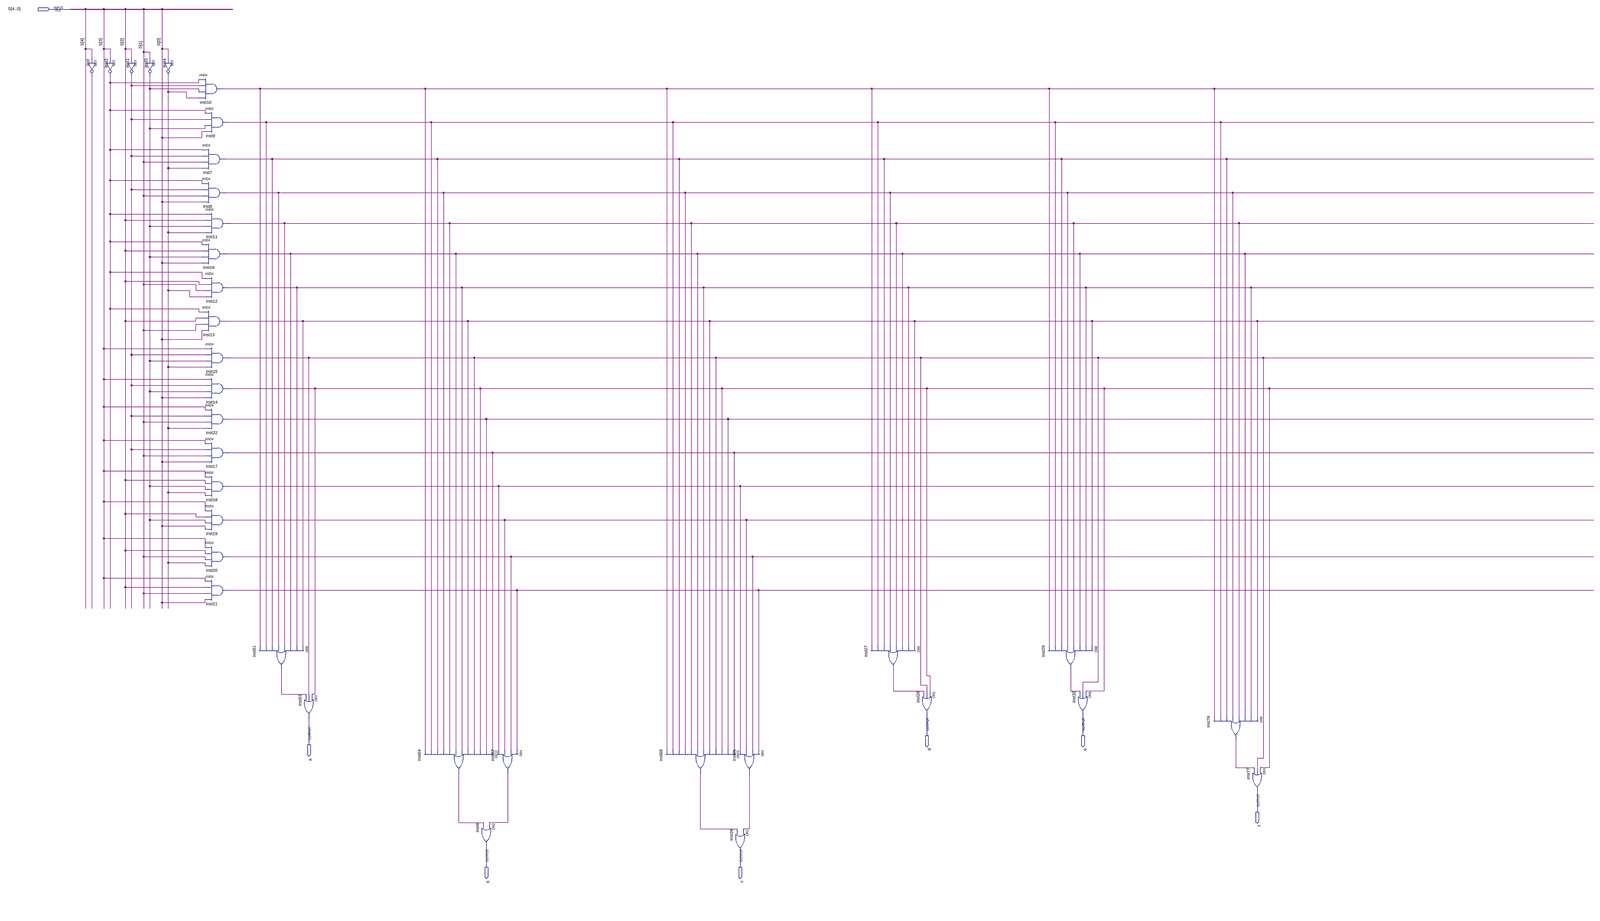
[diagram p0: schematic sheet, whole]
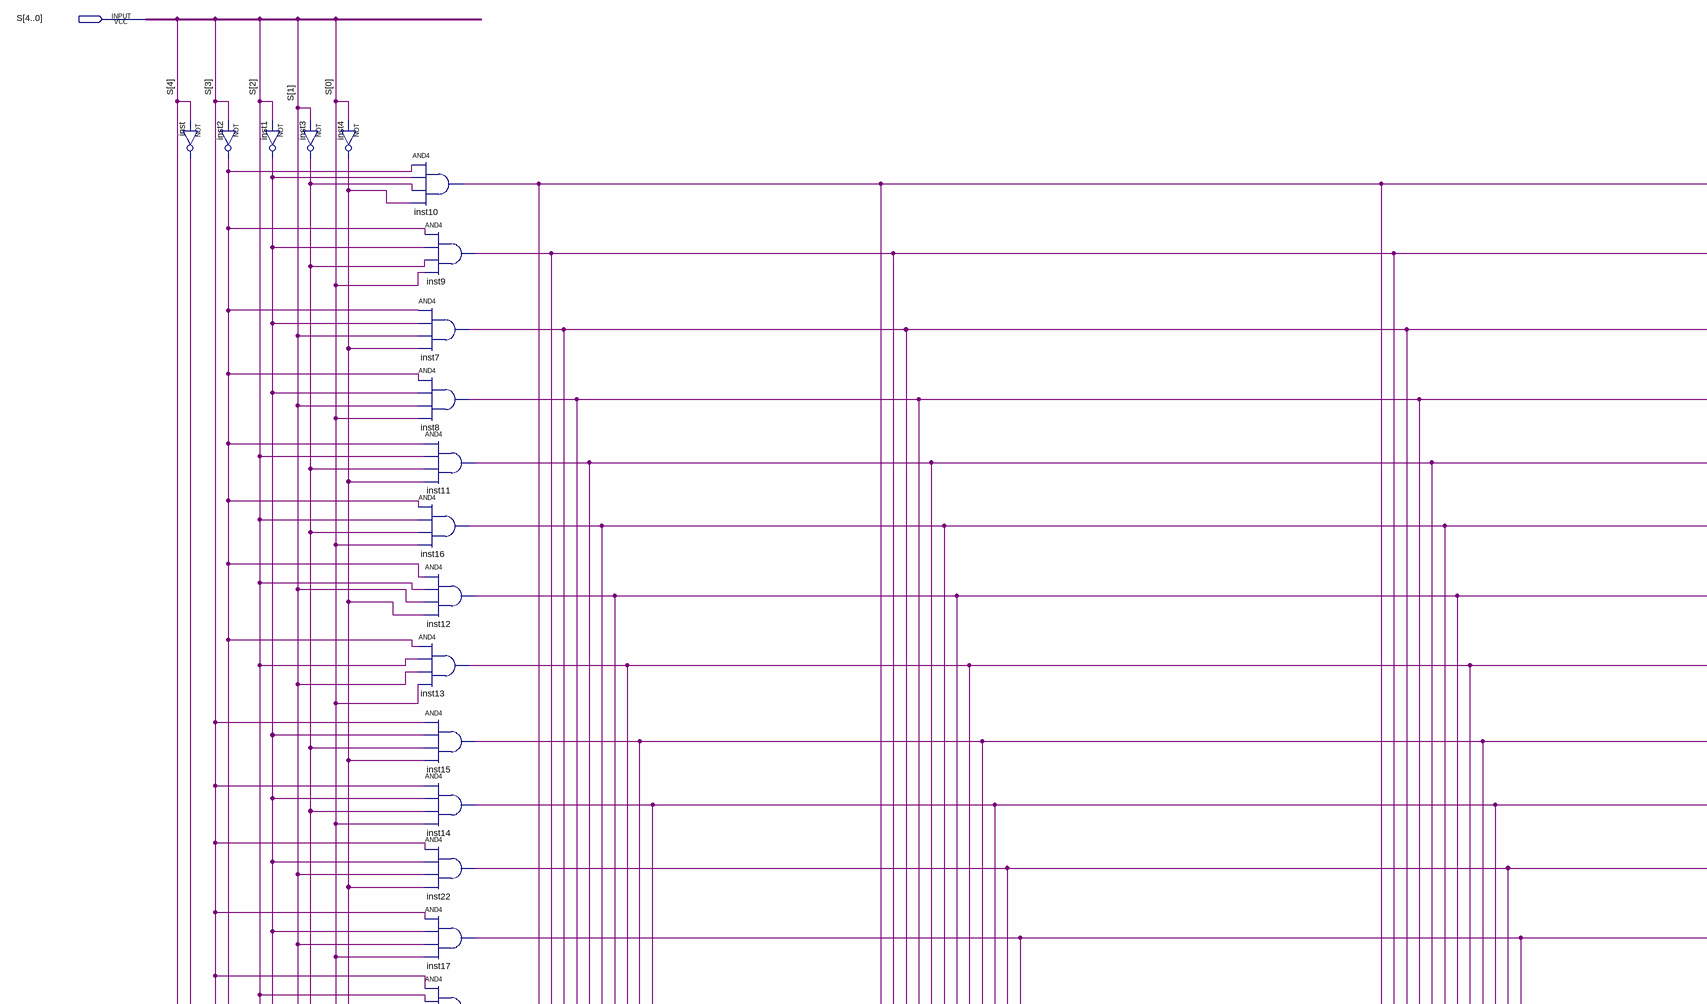
[diagram p1: schematic sheet, upper left part]
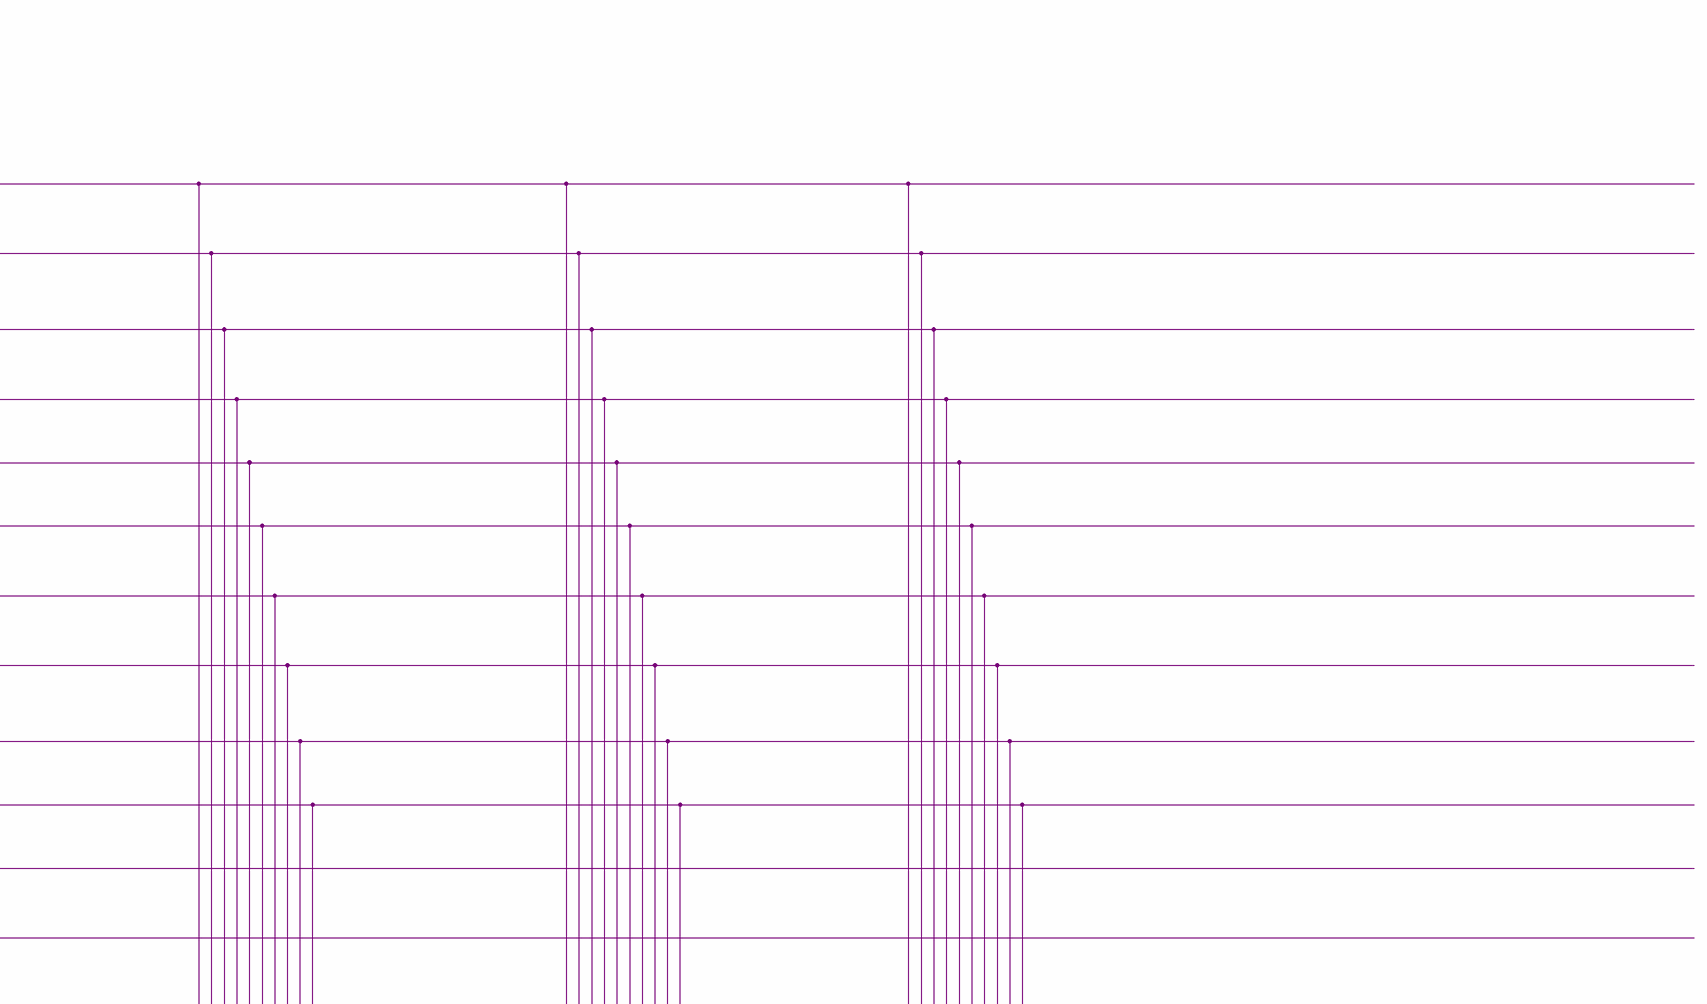
[diagram p2: schematic sheet, upper right part]
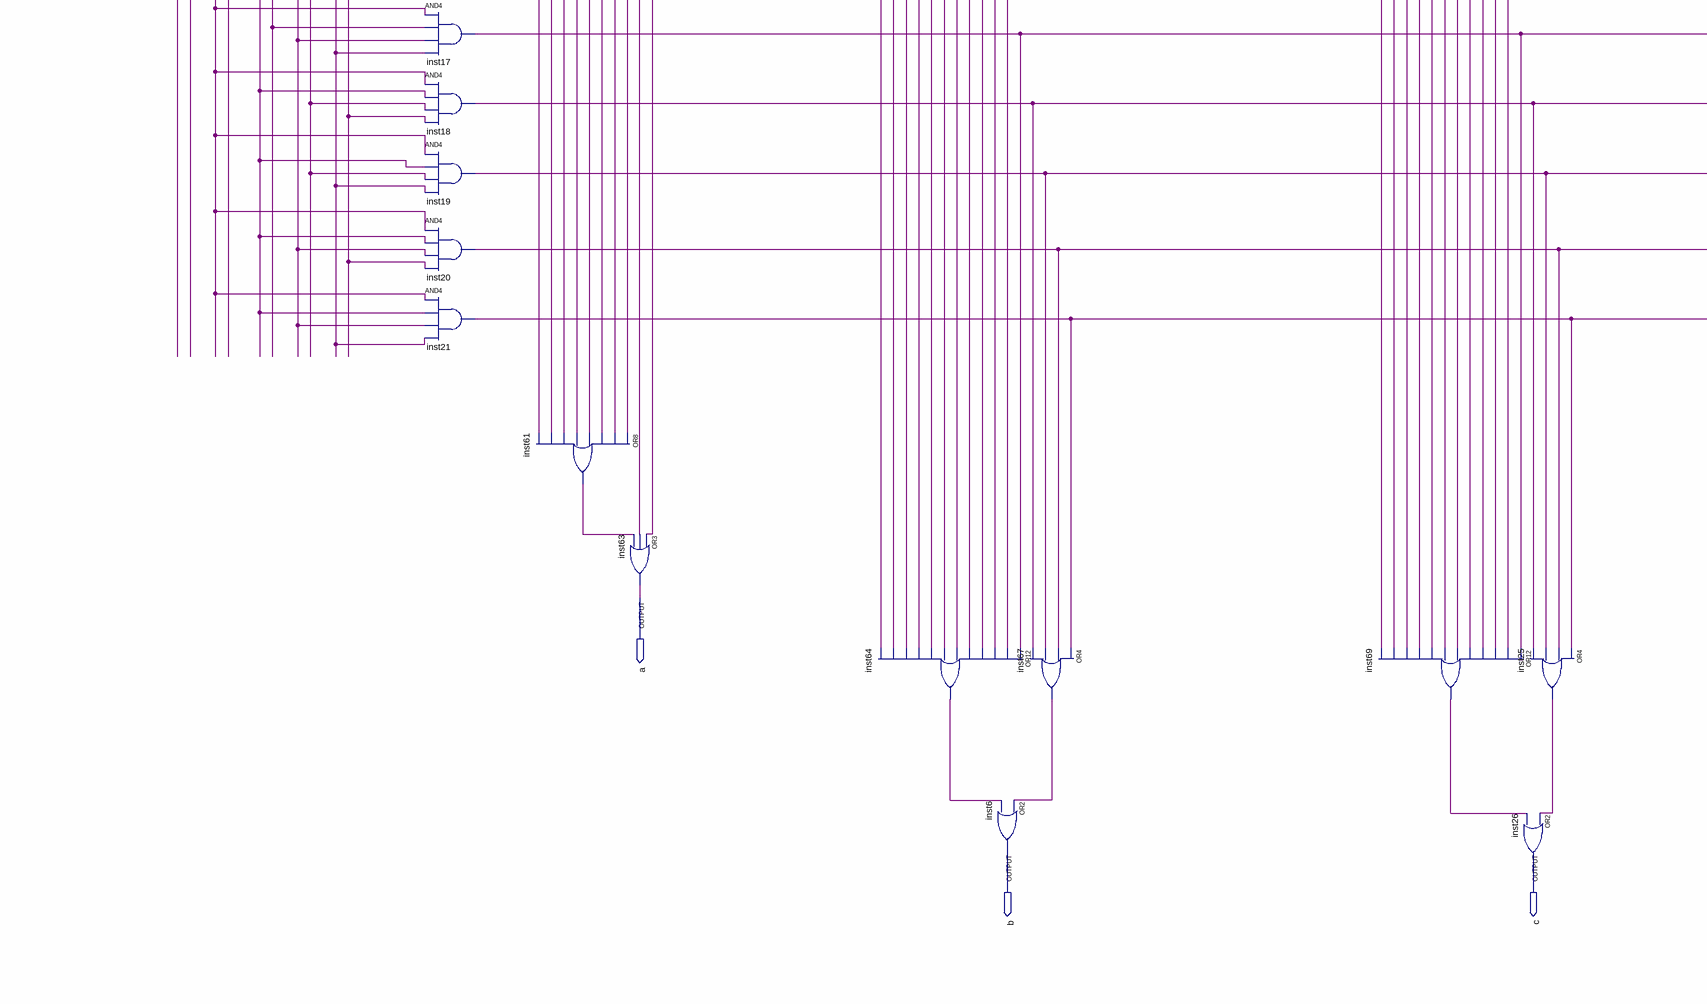
[diagram p3: schematic sheet, lower left part]
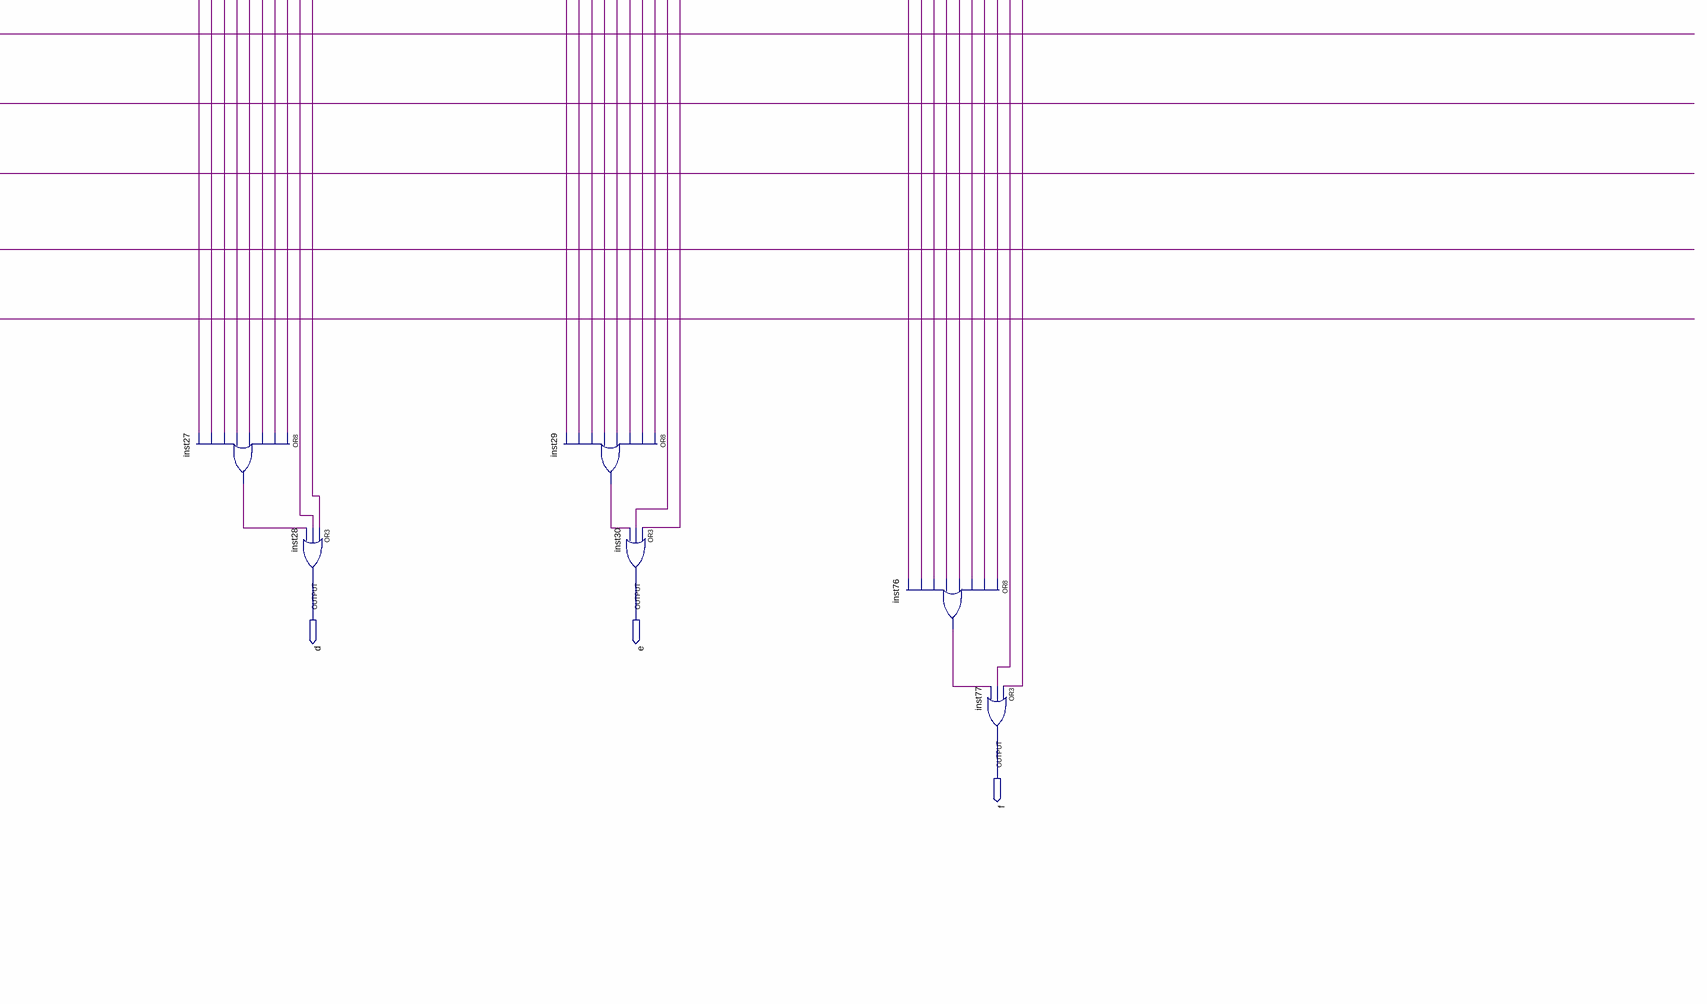
[diagram p4: schematic sheet, lower right part]
// Quartus schematic display4BitsEsquerdo.bdf as structural Verilog: 35 symbols, 7 pins
module display4BitsEsquerdo (
  input  [4:0] S,
  output d,
  output e,
  output a,
  output f,
  output b,
  output c
);

  wire inst1_out, inst2_out, inst3_out, inst4_out, inst7_out, inst8_out, inst9_out, inst10_out, inst11_out,
       inst12_out, inst13_out, inst14_out, inst15_out, inst16_out, inst17_out, inst18_out, inst19_out,
       inst20_out, inst21_out, inst22_out, inst25_out, inst27_out, inst29_out, inst61_out, inst64_out,
       inst67_out, inst69_out, inst76_out, inst_out;

  not inst (inst_out, S[4]);
  not inst2 (inst2_out, S[3]);
  not inst1 (inst1_out, S[2]);
  not inst3 (inst3_out, S[1]);
  not inst4 (inst4_out, S[0]);
  and inst10 (inst10_out, inst2_out, inst1_out, inst3_out, inst4_out);
  and inst7 (inst7_out, inst2_out, inst1_out, S[1], inst4_out);
  and inst8 (inst8_out, inst2_out, inst1_out, S[1], S[0]);
  and inst16 (inst16_out, inst2_out, S[2], inst3_out, S[0]);
  and inst13 (inst13_out, inst2_out, S[2], S[1], S[0]);
  and inst9 (inst9_out, inst2_out, inst1_out, inst3_out, S[0]);
  and inst11 (inst11_out, inst2_out, S[2], inst3_out, inst4_out);
  and inst12 (inst12_out, inst2_out, S[2], S[1], inst4_out);
  and inst15 (inst15_out, S[3], inst1_out, inst3_out, inst4_out);
  and inst14 (inst14_out, S[3], inst1_out, inst3_out, S[0]);
  and inst22 (inst22_out, S[3], inst1_out, S[1], inst4_out);
  and inst17 (inst17_out, S[3], inst1_out, S[1], S[0]);
  and inst18 (inst18_out, S[3], S[2], inst3_out, inst4_out);
  and inst19 (inst19_out, S[3], S[2], inst3_out, S[0]);
  and inst20 (inst20_out, S[3], S[2], S[1], inst4_out);
  and inst21 (inst21_out, S[3], S[2], S[1], S[0]);
  or inst61 (inst61_out, inst13_out, inst12_out, inst16_out, inst11_out, inst8_out, inst7_out, inst9_out, inst10_out);
  or inst63 (a, inst14_out, inst15_out, inst61_out);
  or inst64 (inst64_out, inst17_out, inst22_out, inst14_out, inst15_out, inst13_out, inst12_out, inst16_out, inst11_out, inst8_out, inst7_out, inst9_out, inst10_out);
  or inst67 (inst67_out, inst21_out, inst20_out, inst19_out, inst18_out);
  or inst6 (b, inst67_out, inst64_out);
  or inst69 (inst69_out, inst17_out, inst22_out, inst14_out, inst15_out, inst13_out, inst12_out, inst16_out, inst11_out, inst8_out, inst7_out, inst9_out, inst10_out);
  or inst25 (inst25_out, inst21_out, inst20_out, inst19_out, inst18_out);
  // OR2 inst26 has open pins: IN1=inst25_out, IN2=inst69_out, OUT=open
  or inst27 (inst27_out, inst13_out, inst12_out, inst16_out, inst11_out, inst8_out, inst7_out, inst9_out, inst10_out);
  or inst28 (d, inst14_out, inst15_out, inst27_out);
  or inst29 (inst29_out, inst13_out, inst12_out, inst16_out, inst11_out, inst8_out, inst7_out, inst9_out, inst10_out);
  or inst30 (e, inst14_out, inst15_out, inst29_out);
  or inst76 (inst76_out, inst13_out, inst12_out, inst16_out, inst11_out, inst8_out, inst7_out, inst9_out, inst10_out);
  or inst77 (f, inst14_out, inst15_out, inst76_out);
endmodule
